# EAGLE design signal-board (EAGLE 6.5.0)
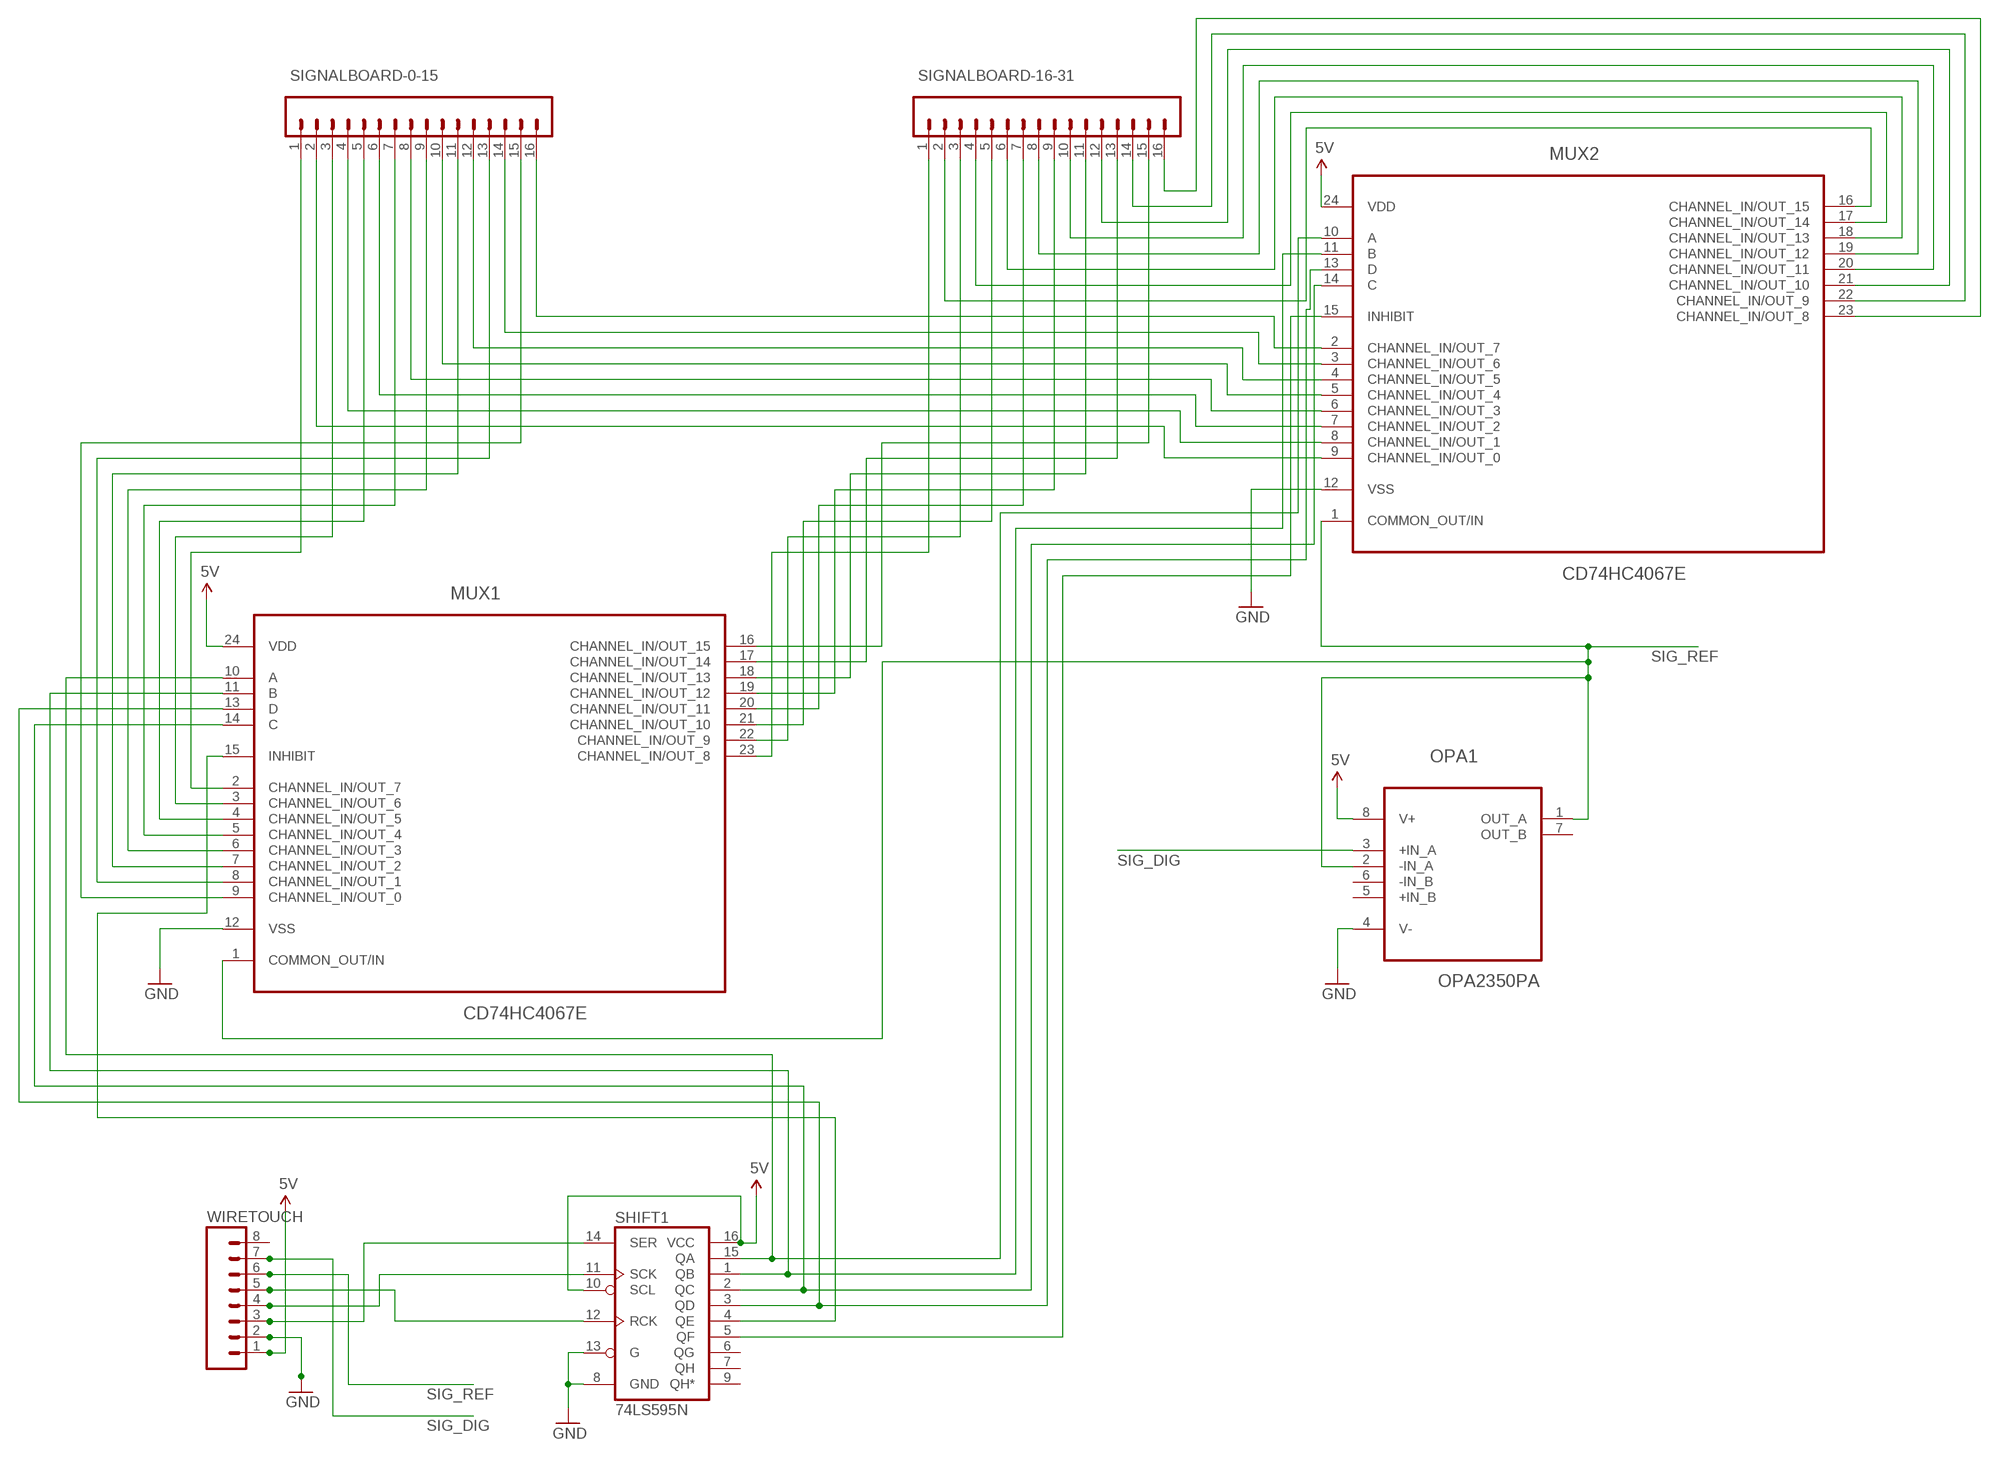
[diagram p0: schematic, sheet 1]

## Parts
MUX1  CD74HC4067E  [PDIP24-WIDE-CD74HC4067E]
MUX2  CD74HC4067E  [PDIP24-WIDE-CD74HC4067E]
OPA1  OPA2350PA  [DIP254P762X508-8]
SHIFT1  74LS595N  [DIL16]
SIGNALBOARD-0-15  M16LOCK_LONGPADS  [1X16_LOCK_LONGPADS]
SIGNALBOARD-16-31  M16LOCK_LONGPADS  [1X16_LOCK_LONGPADS]
WIRETOUCH  M08LONGPADS  [1X08_LONGPADS]

## Nets
5V: MUX1.24(VDD) MUX2.24(VDD) OPA1.8(V+) SHIFT1.10(SCL) SHIFT1.16(VCC) WIRETOUCH.1
GND: MUX1.12(VSS) MUX2.12(VSS) OPA1.4(V-) SHIFT1.8(GND) SHIFT1.13(G) WIRETOUCH.2
N$1: MUX1.2(CHANNEL_IN/OUT_7) SIGNALBOARD-0-15.1
N$2: MUX1.3(CHANNEL_IN/OUT_6) SIGNALBOARD-0-15.3
N$3: MUX1.4(CHANNEL_IN/OUT_5) SIGNALBOARD-0-15.5
N$4: MUX1.5(CHANNEL_IN/OUT_4) SIGNALBOARD-0-15.7
N$5: MUX1.6(CHANNEL_IN/OUT_3) SIGNALBOARD-0-15.9
N$6: MUX1.7(CHANNEL_IN/OUT_2) SIGNALBOARD-0-15.11
N$7: MUX1.8(CHANNEL_IN/OUT_1) SIGNALBOARD-0-15.13
N$8: MUX1.9(CHANNEL_IN/OUT_0) SIGNALBOARD-0-15.15
N$9: MUX1.23(CHANNEL_IN/OUT_8) SIGNALBOARD-16-31.1
N$10: MUX1.22(CHANNEL_IN/OUT_9) SIGNALBOARD-16-31.3
N$11: MUX1.21(CHANNEL_IN/OUT_10) SIGNALBOARD-16-31.5
N$12: MUX1.20(CHANNEL_IN/OUT_11) SIGNALBOARD-16-31.7
N$13: MUX1.19(CHANNEL_IN/OUT_12) SIGNALBOARD-16-31.9
N$14: MUX1.18(CHANNEL_IN/OUT_13) SIGNALBOARD-16-31.11
N$15: MUX1.17(CHANNEL_IN/OUT_14) SIGNALBOARD-16-31.13
N$16: MUX1.16(CHANNEL_IN/OUT_15) SIGNALBOARD-16-31.15
N$17: MUX2.9(CHANNEL_IN/OUT_0) SIGNALBOARD-0-15.2
N$18: MUX2.8(CHANNEL_IN/OUT_1) SIGNALBOARD-0-15.4
N$19: MUX2.7(CHANNEL_IN/OUT_2) SIGNALBOARD-0-15.6
N$20: MUX2.6(CHANNEL_IN/OUT_3) SIGNALBOARD-0-15.8
N$21: MUX2.5(CHANNEL_IN/OUT_4) SIGNALBOARD-0-15.10
N$22: MUX2.4(CHANNEL_IN/OUT_5) SIGNALBOARD-0-15.12
N$23: MUX2.3(CHANNEL_IN/OUT_6) SIGNALBOARD-0-15.14
N$24: MUX2.2(CHANNEL_IN/OUT_7) SIGNALBOARD-0-15.16
N$25: MUX2.16(CHANNEL_IN/OUT_15) SIGNALBOARD-16-31.2
N$26: MUX2.17(CHANNEL_IN/OUT_14) SIGNALBOARD-16-31.4
N$27: MUX2.18(CHANNEL_IN/OUT_13) SIGNALBOARD-16-31.6
N$28: MUX2.19(CHANNEL_IN/OUT_12) SIGNALBOARD-16-31.8
N$29: MUX2.20(CHANNEL_IN/OUT_11) SIGNALBOARD-16-31.10
N$30: MUX2.21(CHANNEL_IN/OUT_10) SIGNALBOARD-16-31.12
N$31: MUX2.22(CHANNEL_IN/OUT_9) SIGNALBOARD-16-31.14
N$32: MUX2.23(CHANNEL_IN/OUT_8) SIGNALBOARD-16-31.16
N$33: MUX1.11(B) MUX2.11(B) SHIFT1.1(QB)
N$34: MUX1.10(A) MUX2.10(A) SHIFT1.15(QA)
N$36: MUX1.14(C) MUX2.14(C) SHIFT1.2(QC)
N$39: SHIFT1.14(SER) WIRETOUCH.3
N$40: MUX1.15(INHIBIT) SHIFT1.4(QE)
N$41: MUX2.15(INHIBIT) SHIFT1.5(QF)
N$42: SHIFT1.11(SCK) WIRETOUCH.4
N$43: MUX1.13(D) MUX2.13(D) SHIFT1.3(QD)
N$44: SHIFT1.12(RCK) WIRETOUCH.5
SIG_DIG: OPA1.3(+IN_A) WIRETOUCH.7
SIG_REF: MUX1.1(COMMON_OUT/IN) MUX2.1(COMMON_OUT/IN) OPA1.1(OUT_A) OPA1.2(-IN_A) WIRETOUCH.6
Unconnected: OPA1.5(+IN_B) OPA1.6(-IN_B) OPA1.7(OUT_B) SHIFT1.6(QG) SHIFT1.7(QH) SHIFT1.9(QH*) WIRETOUCH.8

## Library data of the parts
MUX1 MUX2 = gkaindl:CD74HC4067E: MULTIPLEXERS AND DEMULTIPLEXERS
OPA1 = gkaindl:OPA2350PA: OPERATIONAL AMPLIFIER; MPN: OPA2350PA; OC_FARNELL: 4353316; OC_NEWARK: 75C4730; PACKAGE: PDIP; SUPPLIER: Texas Instruments
SHIFT1 = SparkFun-DigitalIC:74*595: 8-bit SHIFT REGISTER, output latch
SIGNALBOARD-0-15 SIGNALBOARD-16-31 = SparkFun-Connectors:M16: 1x16 .1" header
WIRETOUCH = SparkFun-Connectors:M08: Header 8 Standard 8-pin 0.1" header. Use with straight break away headers (SKU : PRT-00116), right angle break away headers (PRT-00553), swiss pins (PRT-00743), machine pins (PRT-00117), and female headers (PRT-00115).

## Board
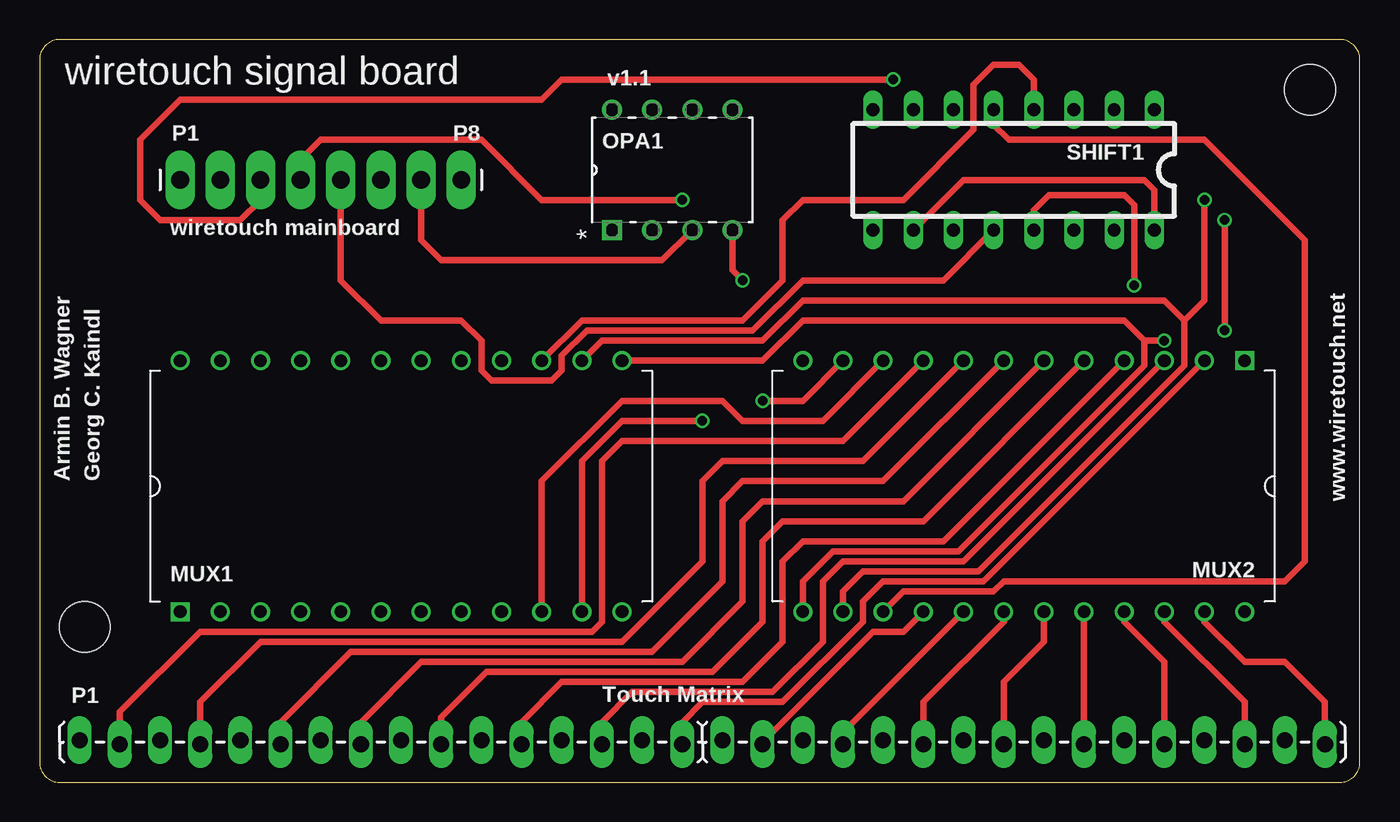
[diagram p1: board, top side]
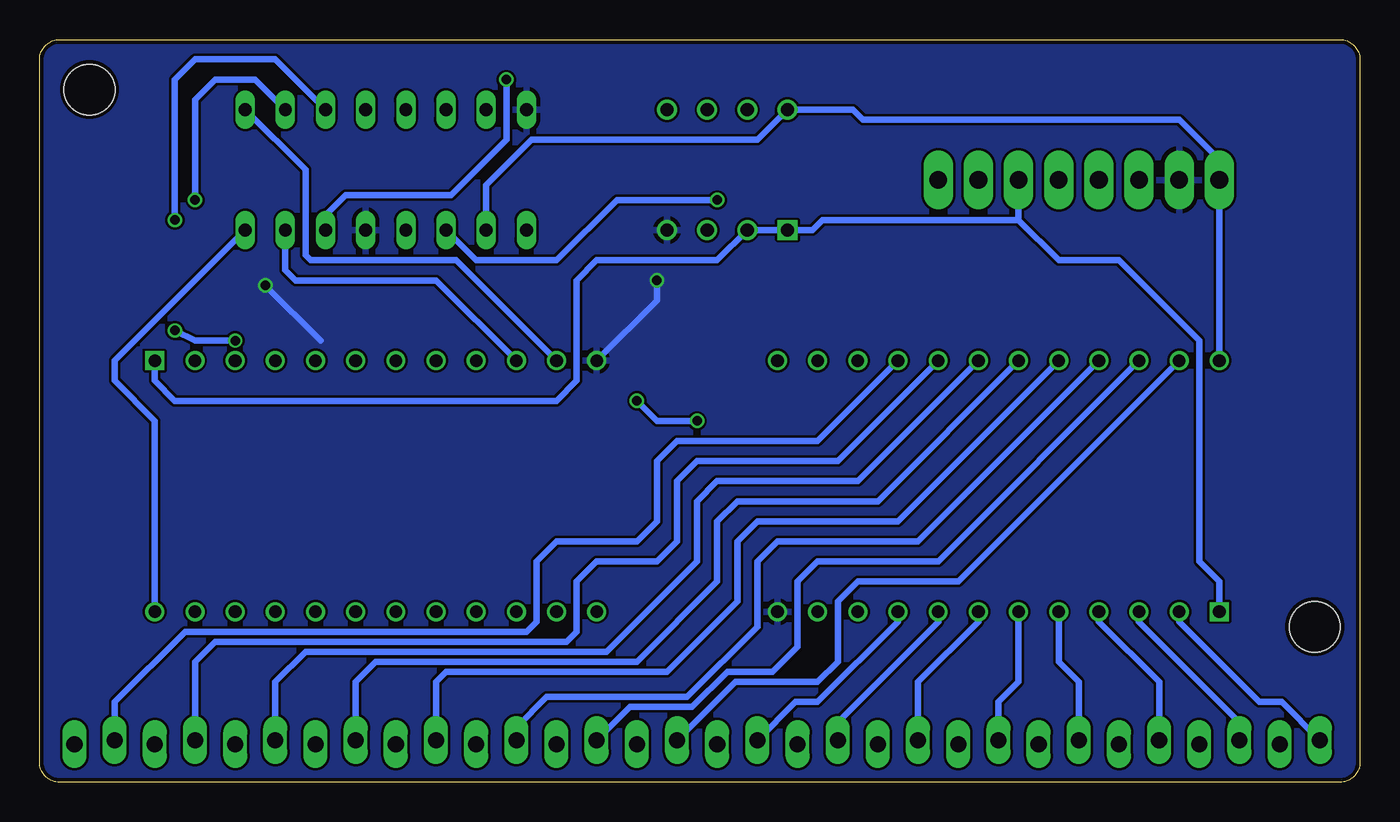
[diagram p2: board, bottom side, seen from below]

Size 83.49 x 46.98 mm. Coordinates in mm from the lower left corner, seen from the top.
Outline: 0,45.71 0,1.27 arc90 1.27,0 82.22,0 arc90 83.49,1.27 83.49,45.71 arc90 82.22,46.98 1.27,46.98 arc90 0,45.71
Copper layers (1*2*15*16): Top 0.035mm / dielectric 0.2mm / layer 2 0.0175mm / dielectric 1.1mm / layer 15 0.0175mm / dielectric 0.2mm / Bottom 0.035mm
Design rules "SeeedStudio_DRU_no_angle_20130527": minimum track width 6mil, minimum drill 12mil, track to track 6mil, track to pad 6mil, pad to pad 6mil, via to via 6mil, smd to smd 0mil, copper to edge 10mil, drill to drill 10mil, minimum pad ring 6mil, minimum via ring 6mil, stop-mask expansion 2mil, vias tented up to drill 25mil, thermal gap 10mil
Holes 3.2 mm at 80.33,43.81 2.86,9.84

### Footprints (pad centres in the part's own frame; a part is rotated, then mirrored left to right if it is on the bottom)
PDIP24-WIDE-CD74HC4067E = drill 0.8 square: 1 0,0 | drill 0.8: 2 2.54,0; 3 5.08,0; 4 7.62,0; 5 10.16,0; 6 12.7,0; 7 15.24,0; 8 17.78,0; 9 20.32,0; 10 22.86,0; 11 25.4,0; 12 27.94,0; 13 27.94,15.875; 14 25.4,15.875; 15 22.86,15.875; 16 20.32,15.875; 17 17.78,15.875; 18 15.24,15.875; 19 12.7,15.875; 20 10.16,15.875; 21 7.62,15.875; 22 5.08,15.875; 23 2.54,15.875; 24 0,15.875
DIP254P762X508-8 = drill 0.838 square: 1 -7.62,7.62 | drill 0.838: 2 -7.62,5.08; 3 -7.62,2.54; 4 -7.62,0; 5 0,0; 6 0,2.54; 7 0,5.08; 8 0,7.62
DIL16 = drill 0.813 long: 1 -8.89,-3.81; 2 -6.35,-3.81; 3 -3.81,-3.81; 4 -1.27,-3.81; 5 1.27,-3.81; 6 3.81,-3.81; 7 6.35,-3.81; 8 8.89,-3.81; 9 8.89,3.81; 10 6.35,3.81; 11 3.81,3.81; 12 1.27,3.81; 13 -1.27,3.81; 14 -3.81,3.81; 15 -6.35,3.81; 16 -8.89,3.81
1X16_LOCK_LONGPADS = drill 1.016 long: 1 0,0.127; 2 2.54,-0.127; 3 5.08,0.127; 4 7.62,-0.127; 5 10.16,0.127; 6 12.7,-0.127; 7 15.24,0.127; 8 17.78,-0.127; 9 20.32,0.127; 10 22.86,-0.127; 11 25.4,0.127; 12 27.94,-0.127; 13 30.48,0.127; 14 33.02,-0.127; 15 35.56,0.127; 16 38.1,-0.127
1X08_LONGPADS = drill 1.118 pad 1.88 long: 1 0,0; 2 2.54,0; 3 5.08,0; 4 7.62,0; 5 10.16,0; 6 12.7,0; 7 15.24,0; 8 17.78,0

### Placement (x,y rotation side)
MUX1  8.89,10.79 0 top
MUX2  76.2,26.67 180 top
OPA1  43.81,42.55 90 top
SHIFT1  61.59,38.73 180 top
SIGNALBOARD-0-15  2.54,2.54 0 top
SIGNALBOARD-16-31  43.18,2.54 0 top
WIRETOUCH  8.89,38.1 0 top

### Tracks (layer width: path | path; a pad name or v marks a point on that pad's centre or on a via)
5V
  Top 0.406: SHIFT1.10 58.42,38.1 69.85,38.1 70.48,37.47 SHIFT1.16
  Bottom 0.406: MUX1.24 WIRETOUCH.1 8.89,39.37 11.43,41.91 31.43,41.91 32.07,42.55 OPA1.8 38.1,40.64 52.39,40.64 55.24,37.78 SHIFT1.10 | MUX2.24 76.2,22.86 78.74,25.4 78.74,26.67 SHIFT1.16
GND  (via drill 0.6)
  Top 0.406: OPA1.4 43.81,32.38 v44.45,31.75 | SHIFT1.13 62.87,36.2 63.82,37.15 68.58,37.15 69.22,36.51 v69.22,31.43
  Bottom 0.406: v44.45,31.75 44.45,30.48 MUX2.12 | 65.72,27.94 v69.22,31.43
  pour Bottom: 0,46.99 83.5,46.99 83.5,0 0,0
N$1
  Bottom 0.406: MUX1.2 11.43,10.16 6.35,5.08 4.95,5.08 SIGNALBOARD-0-15.1
N$2
  Bottom 0.406: MUX1.3 13.97,10.16 7.62,3.81 SIGNALBOARD-0-15.3
N$3
  Bottom 0.406: MUX1.4 16.51,10.16 12.7,6.35 SIGNALBOARD-0-15.5
N$4
  Bottom 0.406: MUX1.5 19.05,7.62 17.78,6.35 SIGNALBOARD-0-15.7
N$5
  Bottom 0.406: MUX1.6 21.59,6.35 22.86,5.08 SIGNALBOARD-0-15.9
N$6
  Bottom 0.406: MUX1.7 24.13,10.16 27.94,6.35 SIGNALBOARD-0-15.11
N$7
  Bottom 0.406: MUX1.8 26.67,10.16 33.02,3.81 SIGNALBOARD-0-15.13
N$8
  Bottom 0.406: MUX1.9 29.21,10.16 34.29,5.08 35.69,5.08 SIGNALBOARD-0-15.15
N$9
  Bottom 0.406: MUX1.23 25.4,12.7 31.75,12.7 33.02,11.43 33.02,7.62 34.29,6.35 39.5,6.35 SIGNALBOARD-16-31.1
N$10
  Bottom 0.406: MUX1.22 26.67,13.97 34.29,13.97 35.56,12.7 35.56,8.57 37.15,6.99 40.01,6.99 42.23,4.76 46.16,4.76 SIGNALBOARD-16-31.3
N$11
  Bottom 0.406: MUX1.21 27.94,15.24 36.83,15.24 38.1,13.97 38.1,9.84 42.55,5.4 51.44,5.4 53.34,3.49 SIGNALBOARD-16-31.5
N$12
  Bottom 0.406: MUX1.20 29.21,16.51 38.1,16.51 39.37,15.24 39.37,11.43 43.81,6.99 57.78,6.99 58.42,6.35 SIGNALBOARD-16-31.7
N$13
  Bottom 0.406: MUX1.19 30.48,17.78 39.37,17.78 40.64,16.51 40.64,12.7 45.72,7.62 62.23,7.62 63.5,6.35 SIGNALBOARD-16-31.9
N$14
  Bottom 0.406: MUX1.18 31.75,19.05 40.64,19.05 41.91,17.78 41.91,13.97 47.62,8.26 66.67,8.26 68.58,6.35 SIGNALBOARD-16-31.11
N$15
  Bottom 0.406: MUX1.17 33.02,20.32 41.91,20.32 43.18,19.05 43.18,15.24 44.45,13.97 48.26,13.97 49.53,12.7 49.53,9.53 50.16,8.89 72.39,8.89 73.66,7.62 SIGNALBOARD-16-31.13
N$16
  Bottom 0.406: MUX1.16 34.29,21.59 43.18,21.59 44.45,20.32 44.45,16.51 45.72,15.24 50.8,15.24 52.07,13.97 52.07,10.16 52.7,9.53 74.3,9.53 78.74,5.08 SIGNALBOARD-16-31.15
N$17
  Top 0.406: MUX2.9 50.8,21.59 36.83,21.59 35.56,20.32 35.56,10.16 34.92,9.53 10.16,9.53 5.08,4.45 SIGNALBOARD-0-15.2
N$18
  Top 0.406: MUX2.8 52.07,20.32 43.18,20.32 41.91,19.05 41.91,13.97 36.83,8.89 13.97,8.89 10.16,5.08 SIGNALBOARD-0-15.4
N$19
  Top 0.406: MUX2.7 53.34,19.05 44.45,19.05 43.18,17.78 43.18,12.7 38.73,8.26 19.68,8.26 15.24,3.81 SIGNALBOARD-0-15.6
N$20
  Top 0.406: MUX2.6 54.61,17.78 45.72,17.78 44.45,16.51 44.45,11.43 40.64,7.62 24.13,7.62 20.32,3.81 SIGNALBOARD-0-15.8
N$21
  Top 0.406: MUX2.5 55.88,16.51 46.99,16.51 45.72,15.24 45.72,10.16 42.55,6.99 28.26,6.99 25.4,4.13 SIGNALBOARD-0-15.10
N$22
  Top 0.406: MUX2.4 57.15,15.24 48.26,15.24 46.99,13.97 46.99,8.89 44.45,6.35 33.02,6.35 30.48,3.81 SIGNALBOARD-0-15.12
N$23
  Top 0.406: MUX2.3 58.42,13.97 50.8,13.97 49.53,12.7 49.53,8.89 46.35,5.71 37.47,5.71 35.56,3.81 SIGNALBOARD-0-15.14
N$24
  Top 0.406: MUX2.2 59.69,12.7 53.34,12.7 52.07,11.43 52.07,10.16 46.99,5.08 41.91,5.08 40.64,3.81 SIGNALBOARD-0-15.16
N$25
  Top 0.406: SIGNALBOARD-16-31.2 45.72,2.54 52.7,9.53 54.61,9.53 MUX2.16
N$26
  Top 0.406: SIGNALBOARD-16-31.4 50.8,3.17 MUX2.17
N$27
  Top 0.406: SIGNALBOARD-16-31.6 55.88,5.08 60.96,10.16 MUX2.18
N$28
  Top 0.406: SIGNALBOARD-16-31.8 60.96,6.35 63.5,8.89 MUX2.19
N$29
  Top 0.406: SIGNALBOARD-16-31.10 MUX2.20
N$30
  Top 0.406: MUX2.21 68.58,10.16 71.12,7.62 SIGNALBOARD-16-31.12
N$31
  Top 0.406: MUX2.22 71.12,10.16 76.2,5.08 SIGNALBOARD-16-31.14
N$32
  Top 0.406: SIGNALBOARD-16-31.16 81.28,5.08 78.74,7.62 76.2,7.62 73.66,10.16 MUX2.23
N$33  (via drill 0.6)
  Top 0.406: MUX2.11 48.26,24.13 v45.72,24.13 | v41.91,22.86 36.83,22.86 34.29,20.32 MUX1.11
  Bottom 0.406: MUX2.11 57.15,33.02 66.36,33.02 66.67,33.34 66.67,38.73 SHIFT1.1 | v45.72,24.13 44.45,22.86 v41.91,22.86
N$34
  Top 0.406: MUX2.10 49.53,22.86 44.45,22.86 43.18,24.13 36.83,24.13 31.75,19.05 MUX1.10
  Bottom 0.406: MUX2.10 58.42,31.75 67.31,31.75 67.94,32.38 SHIFT1.15
N$36  (via drill 0.6)
  Top 0.406: MUX1.14 35.56,27.94 45.72,27.94 48.26,30.48 71.12,30.48 72.39,29.21 | 72.39,29.21 72.39,26.35 59.37,13.34 52.07,13.34 50.8,12.06 MUX2.14 | v73.66,36.83 73.66,30.48 72.39,29.21
  Bottom 0.406: SHIFT1.2 69.85,44.45 72.39,44.45 73.66,43.18 v73.66,36.83
N$39  (via drill 0.6)
  Top 0.406: WIRETOUCH.3 13.97,36.83 12.7,35.56 7.62,35.56 6.35,36.83 6.35,40.64 8.89,43.18 31.75,43.18 33.02,44.45 v53.98,44.45
  Bottom 0.406: v53.98,44.45 53.98,40.64 57.47,37.15 64.14,37.15 65.41,35.88 SHIFT1.14
N$40
  Top 0.406: MUX1.15 34.29,29.21 44.45,29.21 46.99,31.75 46.99,35.56 48.26,36.83 54.61,36.83 59.05,41.27 59.05,44.13 60.33,45.4 61.91,45.4 62.87,44.45 SHIFT1.4
N$41
  Top 0.406: MUX2.15 54.61,12.06 60.33,12.06 60.96,12.7 78.74,12.7 80.01,13.97 80.01,34.29 73.66,40.64 61.28,40.64 60.33,41.59 SHIFT1.5
N$42  (via drill 0.6)
  Top 0.406: WIRETOUCH.4 16.51,39.37 17.78,40.64 27.94,40.64 31.75,36.83 v40.64,36.83
  Bottom 0.406: v40.64,36.83 46.99,36.83 50.8,33.02 55.88,33.02 SHIFT1.11
N$43  (via drill 0.6)
  Top 0.406: MUX1.13 45.72,26.67 48.26,29.21 68.58,29.21 69.85,27.94 | 69.85,27.94 69.85,26.35 58.1,14.61 50.16,14.61 48.26,12.7 MUX2.13 | v74.93,35.56 v74.93,28.57 | v71.12,27.94 69.85,27.94
  Bottom 0.406: SHIFT1.3 68.58,45.72 73.66,45.72 74.93,44.45 v74.93,35.56 | v74.93,28.57 73.66,27.94 v71.12,27.94
N$44
  Top 0.406: SHIFT1.12 57.15,31.75 48.26,31.75 45.09,28.57 34.61,28.57 33.02,26.99 33.02,26.04 32.38,25.4 28.57,25.4 27.94,26.04 27.94,27.94 26.67,29.21 21.59,29.21 19.05,31.75 WIRETOUCH.5
SIG_DIG
  Top 0.406: OPA1.3 39.37,33.02 25.4,33.02 24.13,34.29 WIRETOUCH.7
SIG_REF
  Bottom 0.406: MUX1.1 8.89,12.7 10.16,13.97 10.16,27.94 15.24,33.02 19.05,33.02 21.59,35.56 | 21.59,35.56 WIRETOUCH.6 | 21.59,35.56 33.97,35.56 34.61,34.92 OPA1.1 OPA1.2 40.64,33.02 48.26,33.02 49.53,31.75 49.53,25.4 50.8,24.13 74.93,24.13 76.2,25.4 MUX2.1

### Text on the board
tNames: v1.1 | wiretouch signal board | P1 | P8 | wiretouch mainboard | Armin B. Wagner | Georg C. Kaindl | www.wiretouch.net | P1 | Touch Matrix